# EAGLE board Accumulator Control Unit rev6 (EAGLE 9.6.2)
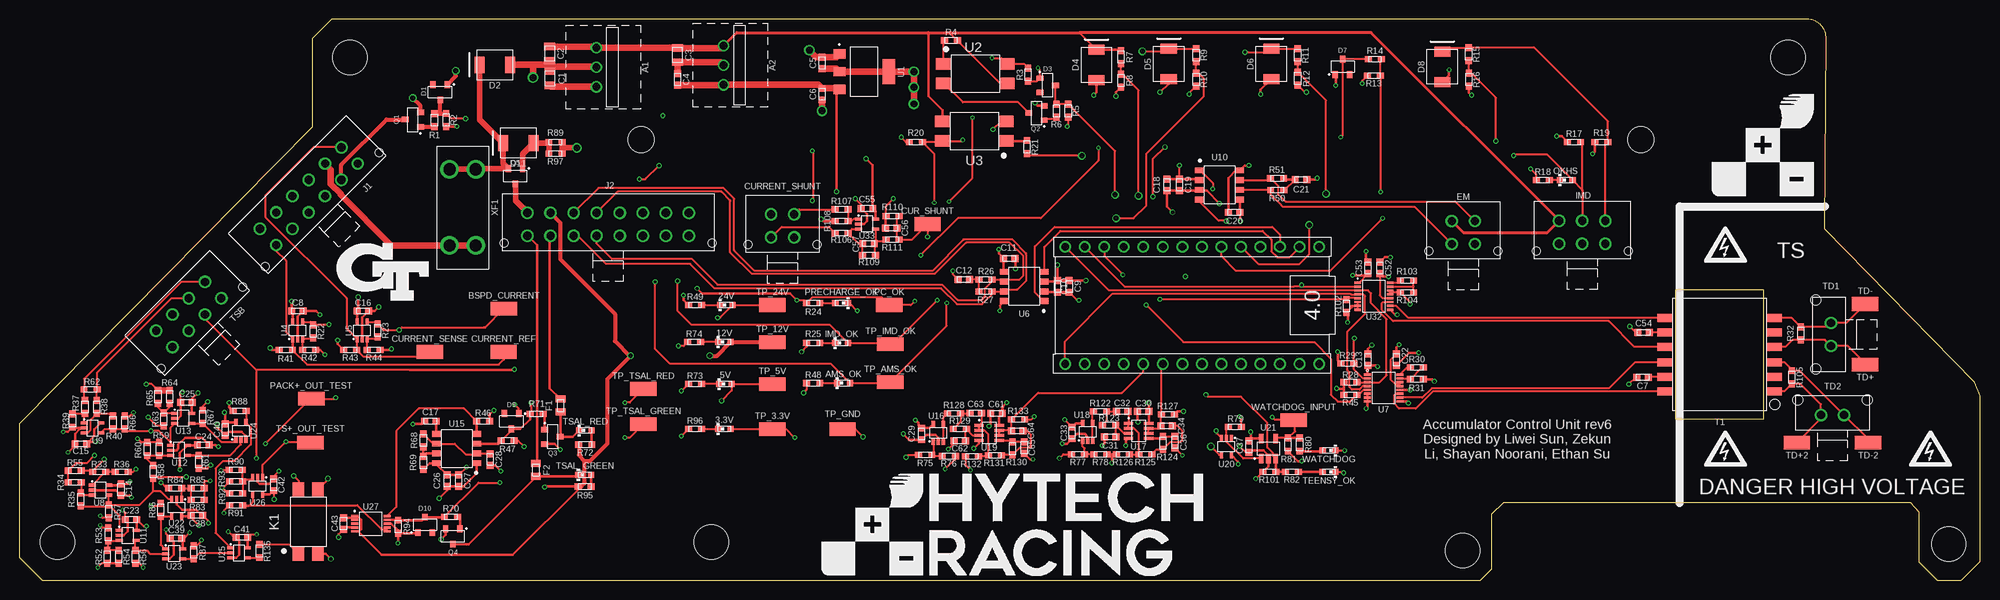
[diagram p6: board, top side]
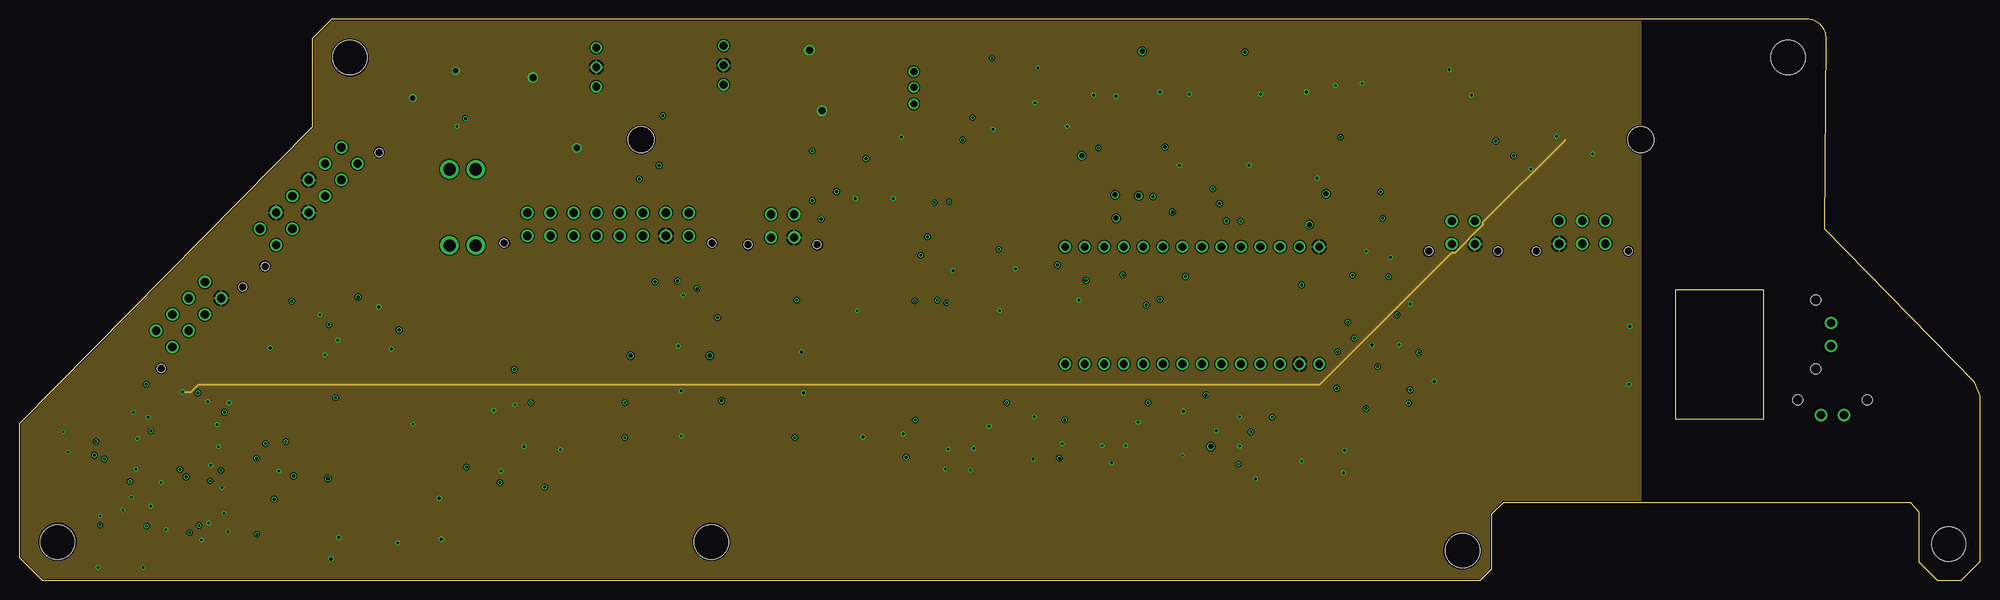
[diagram p7: board, inner layer Route2]
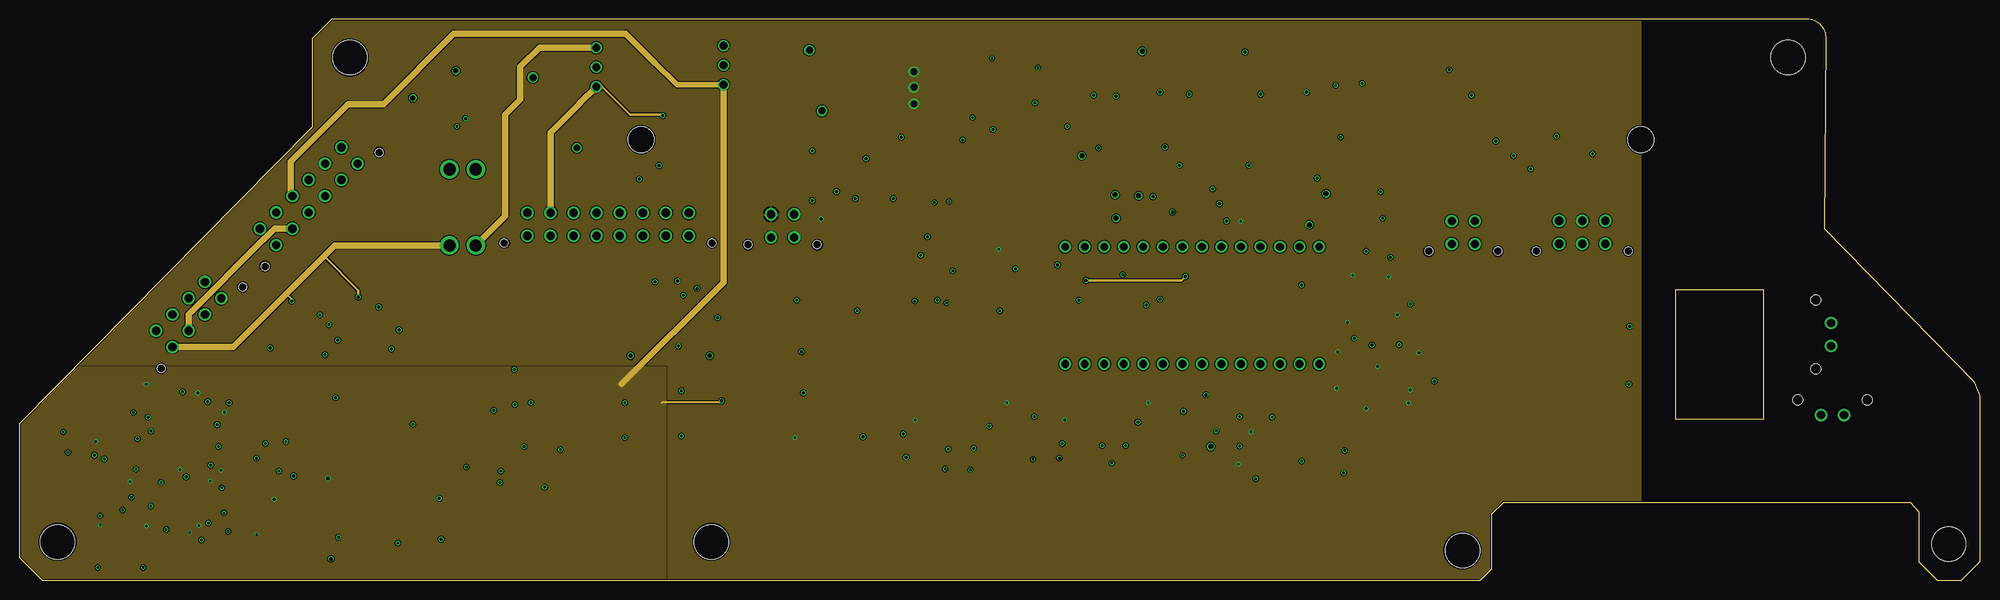
[diagram p8: board, inner layer Route15]
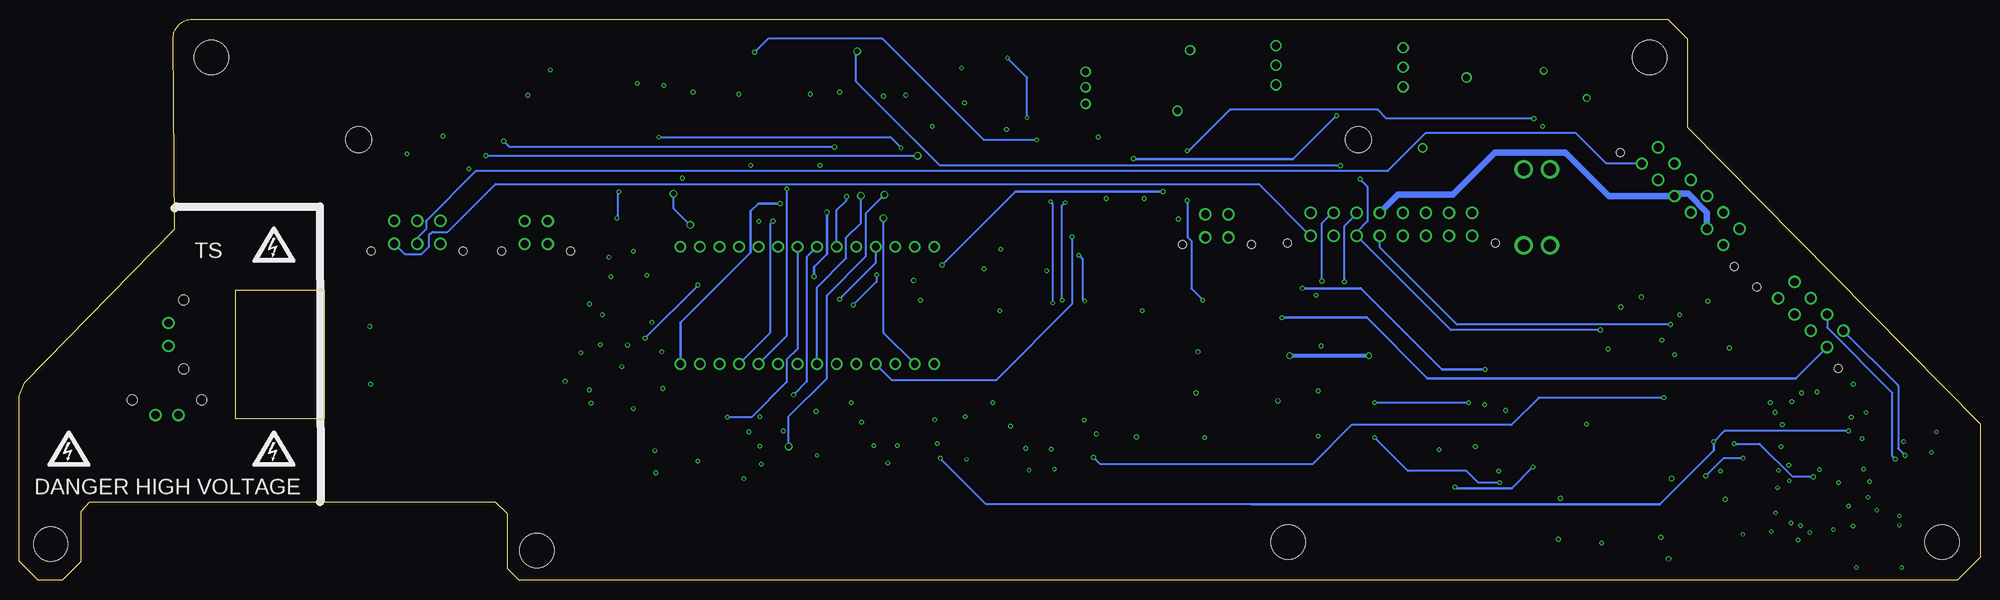
[diagram p9: board, bottom side, seen from below]

Size 255 x 73 mm. Coordinates in mm from the lower left corner, seen from the top.
Outline: 189.99,0 3,0 0,3 0,20.32 38.1,58.93 38.1,70.46 40.64,73 232.48,73 arc-90 234.98,70.48 234.77,45.71 254.29,25.73 255,23.98 255,2.5 252.5,0 249.43,0 247,2.43 247,8.9 245.91,10.16 193.04,10.16 191.52,8.64 191.52,1.52 189.99,0
Outline: 189.99,0 190,0
Copper layers (1+2*15+16): Top 0.035mm / dielectric 0.2mm / Route2 0.0175mm / dielectric 1.065mm / Route15 0.0175mm / dielectric 0.2mm / Bottom 0.035mm
Design rules "JLCPCB (4 Layer)": minimum track width 5mil, minimum drill 0.2mm, track to track 5mil, track to pad 5mil, pad to pad 5mil, via to via 20mil, smd to smd 5mil, copper to edge 0.2mm, drill to drill 21mil, minimum pad ring 6mil, minimum via ring 5mil, stop-mask expansion 2mil, vias tented up to drill 30mil, thermal gap 10mil

## Footprints (pad centres in the part's own frame; a part is rotated, then mirrored left to right if it is on the bottom)
0603-LED = smd 0.8 x 0.8: 1 -0.825,0; 2 0.825,0
OKI-78SR = drill 0.991: 1 -2.54,0; 2 0,0; 3 2.54,0
TEENSY_SHORT = drill 1.016: 3.3V 0,5.08; AGND/GND 0,2.54; D0 15.24,2.54; D1 15.24,5.08; D2 15.24,7.62; D3 15.24,10.16; D4 15.24,12.7; D5 15.24,15.24; D6 15.24,17.78; D7 15.24,20.32; D8 15.24,22.86; D9 15.24,25.4; D10 15.24,27.94; D11 15.24,30.48; D12 15.24,33.02; D13 0,33.02; D14 0,30.48; D15 0,27.94; D16 0,25.4; D17 0,22.86; D18 0,20.32; D19 0,17.78; D20 0,15.24; D21 0,12.7; D22 0,10.16; D23 0,7.62; GND 15.24,0; VIN 0,0
MICRO_MINIATURE = smd 3.429 x 1.778: 1 0,0
0805-CAP = smd 0.95 x 1.4: 1 -0.925,0; 2 0.925,0
0603-CAP = smd 0.9 x 0.9: 1 -0.75,0; 2 0.75,0
5015 = smd 3.429 x 1.778: 1 0,0
MOLEX_MICROFIT_PTH_VERTICAL_04_DUAL = drill 1.067: 1 1.499,-2.997; 2 -1.499,-2.997; 3 1.499,0; 4 -1.499,0 | hole 1.067: 4.496,0.94; -4.496,0.94
SOT-23 = smd 0.711 x 0.889: 1 -0.94,-1.003; 2 0.94,-1.003; 3 0,1.003
DO-214AA = smd 1.27 x 2.1: 1 -1.98,0; 2 1.98,0
1.5SMBJ = smd 1.27 x 2.1: 1 -1.98,0; 2 1.98,0
0603-FUSE = smd 0.914 x 1.27: 1 -0.838,0; 2 0.838,0
MOLEX_MICROFIT_PTH_VERTICAL_06_DUAL = drill 1.067: 1 2.997,-2.997; 2 0,-2.997; 3 -2.997,-2.997; 4 2.997,0; 5 0,0; 6 -2.997,0 | hole 1.067: 5.994,0.94; -5.994,0.94
MOLEX_MICROFIT_PTH_VERTICAL_12_DUAL = drill 1.067: 1 7.493,-2.997; 2 4.496,-2.997; 3 1.499,-2.997; 4 -1.499,-2.997; 5 -4.496,-2.997; 6 -7.493,-2.997; 7 7.493,0; 8 4.496,0; 9 1.499,0; 10 -1.499,0; 11 -4.496,0; 12 -7.493,0 | hole 1.067: 10.49,0.94; -10.49,0.94
MOLEX_MICROFIT_PTH_VERTICAL_16_DUAL = drill 1.067: 1 10.5,-3; 2 7.5,-3; 3 4.5,-3; 4 1.5,-3; 5 -1.5,-3; 6 -4.5,-3; 7 -7.5,-3; 8 -10.5,-3; 9 10.5,0; 10 7.5,0; 11 4.5,0; 12 1.5,0; 13 -1.5,0; 14 -4.5,0; 15 -7.5,0; 16 -10.5,0 | hole 1.067: 13.5,0.94; -13.5,0.94
DIP-4 = smd 1.5 x 1.9: 1 -1.27,-4.15; 2 1.27,-4.15; 3 -1.27,4.15; 4 1.27,4.15
0603-RES = smd 0.9 x 0.8: 1 -0.85,0; 2 0.85,0
HM2112ZNLT_AIRGAP = smd 1.02 x 1.89: 1 -4.78,-7.145; 2 -2.89,-7.145; 3 -1,-7.145; 4 1,-7.145; 5 2.875,-7.145; 6 4.78,-7.145; 7 4.78,7.145; 8 2.89,7.145; 9 1,7.145; 10 -1,7.145; 11 -2.89,7.145; 12 -4.78,7.145
MOLEX_MICROFIT_PTH_VERTICAL_02_SINGLE = drill 1.067: 1 1.499,0; 2 -1.499,0 | hole 1.321: 4.496,-1.956; -4.496,-1.956
MOLEX_MICROFIT_PTH_VERTICAL_08_DUAL = drill 1.067: 1 4.496,-2.997; 2 1.499,-2.997; 3 -1.499,-2.997; 4 -4.496,-2.997; 5 4.496,0; 6 1.499,0; 7 -1.499,0; 8 -4.496,0 | hole 1.067: 7.493,0.94; -7.493,0.94
SOT-223 = smd 1.2 x 1.6: 1 -2.3,-3.2; 2 0,-3.2; 3 2.3,-3.2 | smd 3.3 x 1.6: 4 0,3.2
SC-70-5 = smd 0.4 x 0.9: 1 -0.65,-1.1; 2 0,-1.1; 3 0.65,-1.1; 4 0.65,1.1; 5 -0.65,1.1
SOIC-08(NARROW,0.15") = smd 0.762 x 1.143: 1 -1.905,-2.603; 2 -0.635,-2.603; 3 0.635,-2.603; 4 1.905,-2.603; 5 1.905,2.603; 6 0.635,2.603; 7 -0.635,2.603; 8 -1.905,2.603
MSOP-16 = smd 0.305 x 0.889: 1 -1.75,-2.106; 2 -1.25,-2.106; 3 -0.75,-2.106; 4 -0.25,-2.106; 5 0.25,-2.106; 6 0.75,-2.106; 7 1.25,-2.106; 8 1.75,-2.106; 9 1.75,2.106; 10 1.25,2.106; 11 0.75,2.106; 12 0.25,2.106; 13 -0.25,2.106; 14 -0.75,2.106; 15 -1.25,2.106; 16 -1.75,2.106
SOT-23-8 = smd 0.4 x 1.22: 1 -0.975,-1.31; 2 -0.325,-1.31; 3 0.325,-1.31; 4 0.975,-1.31; 5 0.975,1.31; 6 0.325,1.31; 7 -0.325,1.31; 8 -0.975,1.31
SOT-23-5 = smd 0.62 x 1.22: 1 -0.95,-1.31; 2 0,-1.31; 3 0.95,-1.31; 4 0.95,1.31; 5 -0.95,1.31
MSOP-10 = smd 0.305 x 0.889: 1 -1,-2.106; 2 -0.5,-2.106; 3 0,-2.106; 4 0.5,-2.106; 5 1,-2.106; 6 1,2.106; 7 0.5,2.106; 8 0,2.106; 9 -0.5,2.106; 10 -1,2.106
MOUNTING_M4 = hole 4.5: 0,0
MOUNTING_M3 = hole 3.4: 0,0
3568 = drill 1.6: 1 -4.953,1.702; 2 -4.953,-1.702; 3 4.953,-1.702; 4 4.953,1.702

## Placement (x,y rotation side)
3.3V  LED_0603_GREEN  [0603-LED]  91.69,19.68 0 top
5V  LED_0603_BLUE  [0603-LED]  91.82,25.53 0 top
12V  LED_0603_RED  [0603-LED]  91.69,30.99 0 top
24V  LED_0603_ORANGE  [0603-LED]  91.95,35.81 0 top
A1  VOLTAGE_REGULATOR_MODULE_OKI-78SR_12V  [OKI-78SR]  75.05,66.76 270 top
A2  VOLTAGE_REGULATOR_MODULE_OKI-78SR_5V  [OKI-78SR]  91.59,67.02 270 top
A3  TEENSY_4.0TH  [TEENSY_SHORT]  169.02,28.16 90 top
AMS_OK  LED_0603_GREEN  [0603-LED]  107.19,25.65 0 top
BSPD_CURRENT  TEST_POINT  [MICRO_MINIATURE]  63.02,35.33 180 top
C1  CAPACITOR_0805_50V_10UF  [0805-CAP]  68.99,65.31 90 top
C2  CAPACITOR_0805_50V_10UF  [0805-CAP]  68.98,68.53 270 top
C3  CAPACITOR_0805_50V_10UF  [0805-CAP]  85.6,68.33 270 top
C4  CAPACITOR_0603_25V_10UF  [0603-CAP]  85.6,65.15 90 top
C5  CAPACITOR_0603_10V_4.7UF  [0603-CAP]  104.39,67.31 90 top
C6  CAPACITOR_0603_10V_1UF  [0603-CAP]  104.39,63.25 270 top
C7  CAPACITOR_0603_10V_10NF  [0603-CAP]  211.07,26.42 180 top
C8  CAPACITOR_0603_50V_0.1UF  [0603-CAP]  36.2,35.05 0 top
C9  CAPACITOR_0603_10V_1UF  [0603-CAP]  136.53,38.23 90 top
C10  CAPACITOR_0603_10V_0.1UF  [0603-CAP]  135,38.23 90 top
C11  CAPACITOR_0603_10V_0.1UF  [0603-CAP]  128.75,41.86 180 top
C12  CAPACITOR_0603_10V_4.7NF  [0603-CAP]  122.83,39.13 0 top
C13  CAPACITOR_0603_10V_10NF  [0603-CAP]  175.39,28.7 270 top
C14  CAPACITOR_0603_10V_0.1UF  [0603-CAP]  13.23,11.81 270 top
C15  CAPACITOR_0603_10V_0.1UF  [0603-CAP]  8,17.75 180 top
C16  CAPACITOR_0603_50V_0.1UF  [0603-CAP]  44.7,35.05 0 top
C17  CAPACITOR_0603_10V_10NF  [0603-CAP]  53.47,20.7 180 top
C18  CAPACITOR_0603_10V_1UF  [0603-CAP]  149.22,51.44 270 top
C19  CAPACITOR_0603_10V_0.1UF  [0603-CAP]  150.88,51.44 270 top
C20  CAPACITOR_0603_10V_0.1UF  [0603-CAP]  157.99,47.88 0 top
C21  CAPACITOR_0603_10V_4.7NF  [0603-CAP]  166.67,52.15 180 top
C22  CAPACITOR_0603_10V_0.1UF  [0603-CAP]  179.07,28.7 90 top
C23  CAPACITOR_0603_10V_0.1UF  [0603-CAP]  14.55,7.9 180 top
C24  CAPACITOR_0603_10V_0.1UF  [0603-CAP]  23.93,17.63 0 top
C25  CAPACITOR_0603_10V_0.1UF  [0603-CAP]  21.77,23.16 180 top
C26  CAPACITOR_0603_25V_0.1UF  [0603-CAP]  55.63,12.95 270 top
C27  CAPACITOR_0603_25V_1UF  [0603-CAP]  57.15,12.95 270 top
C28  CAPACITOR_0603_10V_4.7UF  [0603-CAP]  61.21,15.72 270 top
C29  CAPACITOR_0603_25V_0.1UF  [0603-CAP]  117.35,19.05 270 top
C30  CAPACITOR_0603_10V_0.1UF  [0603-CAP]  146.18,21.97 180 top
C31  CAPACITOR_0603_16V_0.47UF  [0603-CAP]  141.86,18.67 180 top
C32  CAPACITOR_0603_10V_1UF  [0603-CAP]  143.41,22 180 top
C33  CAPACITOR_0603_10V_0.1UF  [0603-CAP]  136.91,19.18 270 top
C34  CAPACITOR_0603_10V_1UF  [0603-CAP]  149.22,20.07 0 top
C36  CAPACITOR_0603_16V_0.47UF  [0603-CAP]  150.27,17.96 270 top
C37  CAPACITOR_0603_10V_0.1UF  [0603-CAP]  159.89,17.4 90 top
C38  CAPACITOR_0603_10V_0.1UF  [0603-CAP]  23.11,8.43 0 top
C39  CAPACITOR_0603_10V_0.1UF  [0603-CAP]  20.4,5.49 180 top
C40  CAPACITOR_0603_10V_0.1UF  [0603-CAP]  26.77,19.61 270 top
C41  CAPACITOR_0603_10V_0.1UF  [0603-CAP]  28.98,5.59 180 top
C42  CAPACITOR_0603_10V_0.1UF  [0603-CAP]  33.07,12.42 90 top
C43  CAPACITOR_0603_25V_1UF  [0603-CAP]  42.16,7.39 270 top
C52  CAPACITOR_0603_10V_10NF  [0603-CAP]  176.91,40.64 270 top
C53  CAPACITOR_0603_10V_0.1UF  [0603-CAP]  175.39,40.64 90 top
C54  CAPACITOR_0603_10V_10NF  [0603-CAP]  211.2,32.26 180 top
C55  CAPACITOR_0603_25V_1UF  [0603-CAP]  110.24,48.39 180 top
C56  CAPACITOR_0603_10V_68NF  [0603-CAP]  113.41,45.85 180 top
C57  CAPACITOR_0603_10V_68NF  [0603-CAP]  110.44,43.81 180 top
C61  CAPACITOR_0603_10V_0.1UF  [0603-CAP]  127.08,21.72 180 top
C62  CAPACITOR_0603_16V_0.47UF  [0603-CAP]  122.3,18.16 180 top
C63  CAPACITOR_0603_10V_1UF  [0603-CAP]  124.36,21.74 180 top
C64  CAPACITOR_0603_10V_1UF  [0603-CAP]  129.79,19.43 0 top
C65  CAPACITOR_0603_16V_0.47UF  [0603-CAP]  130.68,17.27 270 top
CUR_SHUNT  TEST_POINT  [5015]  118.11,46.35 0 top
CURRENT_REF  TEST_POINT  [MICRO_MINIATURE]  62.99,29.72 0 top
CURRENT_SENSE  TEST_POINT  [MICRO_MINIATURE]  53.39,29.72 0 top
CURRENT_SHUNT  CONNECTOR-4_μF_T_V_BLACK  [MOLEX_MICROFIT_PTH_VERTICAL_04_DUAL]  99.27,44.61 180 top
D1  TVS__8V  [SOT-23]  54.74,63.5 180 top
D2  TVS_DO-214AA_30V  [DO-214AA]  61.85,67.06 180 top
D3  TVS__8V  [SOT-23]  133.73,64.39 270 top
D4  TVS_DO-214AA_28V  [DO-214AA]  140.08,67.06 90 top
D5  TVS_DO-214AA_28V  [DO-214AA]  149.48,67.18 90 top
D6  TVS_DO-214AA_28V  [DO-214AA]  162.81,67.18 90 top
D7  TVS__8V  [SOT-23]  172.09,66.8 0 top
D8  TVS_DO-214AA_28V  [DO-214AA]  185.04,66.8 90 top
D9  TVS__15V  [SOT-23]  64.01,20.7 180 top
D10  TVS__15V  [SOT-23]  52.76,7.21 0 top
D11  ZENER_1.5SMBJ_12V  [1.5SMBJ]  64.9,56.9 180 top
EM  CONNECTOR-4_μF_T_V_BLACK  [MOLEX_MICROFIT_PTH_VERTICAL_04_DUAL]  187.78,43.75 180 top
F1  FUSE_0603_.75A  [0603-FUSE]  70.38,22.73 270 top
F2  FUSE_0603_.75A  [0603-FUSE]  67.18,14.35 270 top
IMD  CONNECTOR-6_μF_T_V_BLACK  [MOLEX_MICROFIT_PTH_VERTICAL_06_DUAL]  203.24,43.78 180 top
IMD_OK  LED_0603_ORANGE  [0603-LED]  106.93,30.86 0 top
J1  CONNECTOR-12_MF_T_V_  [MOLEX_MICROFIT_PTH_VERTICAL_12_DUAL]  38.71,48.92 225 top
J2  CONNECTOR-16_MF_T_V_  [MOLEX_MICROFIT_PTH_VERTICAL_16_DUAL]  76.58,44.82 180 top
K1  RELAY_SOLIDSTATE_NO_DIP-4  [DIP-4]  37.59,7.62 0 top
OKHS  LED_0603_YELLOW  [0603-LED]  201.17,52.07 0 top
PACK+_OUT_TEST  TEST_POINT  [MICRO_MINIATURE]  37.97,23.62 0 top
PC_OK  TEST_POINT  [MICRO_MINIATURE]  113.16,35.81 0 top
PRECHARGE_OK  LED_0603_RED  [0603-LED]  106.93,36.07 180 top
Q1  TRANSISTOR_N_MOS__PMV15ENEA  [SOT-23]  51.18,59.94 90 top
Q2  TRANSISTOR_N_MOS__PMV15ENEA  [SOT-23]  132.28,60.81 90 top
Q3  TRANSISTOR_N_MOS__PMV15ENEA  [SOT-23]  69.34,18.67 270 top
Q4  TRANSISTOR_N_MOS__PMV15ENEA  [SOT-23]  56.39,5.71 180 top
Q5  TRANSISTOR_P_MOS_SOT-23_DMP3056L-7  [SOT-23]  64.52,52.58 180 top
R1  RESISTOR_0603_10  [0603-RES]  53.98,59.87 270 top
R2  RESISTOR_0603_10K  [0603-RES]  55.5,59.89 270 top
R3  RESISTOR_0603_20K  [0603-RES]  131.19,65.79 90 top
R4  RESISTOR_0603_5.1K  [0603-RES]  121.16,70.23 0 top
R5  RESISTOR_0603_10K  [0603-RES]  136.4,61.09 270 top
R6  RESISTOR_0603_10  [0603-RES]  134.87,61.09 270 top
R7  RESISTOR_0603_36.5K  [0603-RES]  143.26,68.07 270 top
R8  RESISTOR_0603_4.64K  [0603-RES]  143.26,65.02 270 top
R9  RESISTOR_0603_36.5K  [0603-RES]  153.03,68.33 270 top
R10  RESISTOR_0603_4.64K  [0603-RES]  153.03,65.15 270 top
R11  RESISTOR_0603_36.5K  [0603-RES]  166.24,68.33 270 top
R12  RESISTOR_0603_4.64K  [0603-RES]  166.24,65.28 270 top
R13  RESISTOR_0603_  [0603-RES]  176.15,65.66 180 top
R14  RESISTOR_0603_18.7K  [0603-RES]  176.28,67.82 0 top
R15  RESISTOR_0603_  [0603-RES]  188.47,68.45 270 top
R16  RESISTOR_0603_5.1K  [0603-RES]  188.49,65.15 270 top
R17  RESISTOR_0603_2.2K  [0603-RES]  202.18,57.02 0 top
R18  RESISTOR_0603_2K  [0603-RES]  198.12,52.07 0 top
R19  RESISTOR_0603_2.2K  [0603-RES]  205.74,57.02 0 top
R20  RESISTOR_0603_20K  [0603-RES]  116.59,57.02 0 top
R21  RESISTOR_0603_5.1K  [0603-RES]  131.06,56.39 90 top
R22  RESISTOR_0603_10.5K  [0603-RES]  38.23,32.38 90 top
R23  RESISTOR_0603_10.5K  [0603-RES]  46.61,32.51 90 top
R24  RESISTOR_0603_1K  [0603-RES]  103.25,36.07 180 top
R25  RESISTOR_0603_2K  [0603-RES]  103.25,30.86 0 top
R26  RESISTOR_0603_60.4  [0603-RES]  125.65,39.12 0 top
R27  RESISTOR_0603_60.4  [0603-RES]  125.64,37.59 0 top
R28  RESISTOR_0603_2K  [0603-RES]  173.1,25.78 180 top
R29  RESISTOR_0603_2K  [0603-RES]  172.72,28.19 180 top
R30  RESISTOR_0603_1.65K  [0603-RES]  181.74,27.69 0 top
R31  RESISTOR_0603_470  [0603-RES]  181.74,26.16 0 top
R32  RESISTOR_0603_120  [0603-RES]  231.65,32.13 270 top
R33  RESISTOR_0603_18.7K_LT  [0603-RES]  10.41,14.1 0 top
R34  RESISTOR_0603_18.7K_LT  [0603-RES]  7.24,12.75 0 top
R35  RESISTOR_0603_43K_LT  [0603-RES]  8,10.54 270 top
R36  RESISTOR_0603_43K_LT  [0603-RES]  13.34,14.1 0 top
R37  RESISTOR_0603_18.7K_LT  [0603-RES]  8.56,22.56 270 top
R38  RESISTOR_0603_18.7K_LT  [0603-RES]  10.08,22.56 270 top
R39  RESISTOR_0603_43K_LT  [0603-RES]  6.93,20.78 270 top
R40  RESISTOR_0603_43K_LT  [0603-RES]  12.19,20.52 270 top
R41  RESISTOR_0603_DNP  [0603-RES]  34.67,29.97 0 top
R42  RESISTOR_0603_2.74K  [0603-RES]  37.72,29.97 180 top
R43  RESISTOR_0603_100K  [0603-RES]  43.05,29.97 0 top
R44  RESISTOR_0603_2.74K  [0603-RES]  46.1,29.97 180 top
R45  RESISTOR_0603_1K  [0603-RES]  173.1,24.13 180 top
R46  RESISTOR_0603_10K  [0603-RES]  60.33,20.7 180 top
R47  RESISTOR_0603_10K  [0603-RES]  63.5,18.16 0 top
R48  RESISTOR_0603_2K  [0603-RES]  103.25,25.65 0 top
R49  RESISTOR_0603_3.3K  [0603-RES]  87.88,35.81 0 top
R50  RESISTOR_0603_60.4  [0603-RES]  163.58,50.77 180 top
R51  RESISTOR_0603_60.4  [0603-RES]  163.57,52.3 180 top
R52  RESISTOR_0603_DNP  [0603-RES]  11.43,3.05 90 top
R53  RESISTOR_0603_5.9K  [0603-RES]  11.56,5.97 90 top
R54  RESISTOR_0603_11.5K  [0603-RES]  12.95,3.05 90 top
R55  RESISTOR_0603_10K  [0603-RES]  7.24,14.27 0 top
R56  RESISTOR_0603_10K  [0603-RES]  15.11,3.05 90 top
R57  RESISTOR_0603_10K  [0603-RES]  11.63,8.97 90 top
R58  RESISTOR_0603_36.5K  [0603-RES]  17.42,14.12 270 top
R59  RESISTOR_0603_330K  [0603-RES]  18.21,17.07 270 top
R60  RESISTOR_0603_DNP  [0603-RES]  16.66,17.07 270 top
R61  RESISTOR_0603_10K  [0603-RES]  23.32,15.42 90 top
R62  RESISTOR_0603_10K  [0603-RES]  9.27,24.84 180 top
R63  RESISTOR_0603_14K  [0603-RES]  18.8,20.95 90 top
R64  RESISTOR_0603_DNP  [0603-RES]  19.56,23.88 90 top
R65  RESISTOR_0603_1K  [0603-RES]  18.03,23.88 90 top
R66  RESISTOR_0603_10K  [0603-RES]  13.72,20.52 270 top
R67  RESISTOR_0603_10K  [0603-RES]  23.88,21.29 270 top
R68  RESISTOR_0603_43K  [0603-RES]  52.55,18.21 270 top
R69  RESISTOR_0603_10K  [0603-RES]  52.55,15.29 270 top
R70  RESISTOR_0603_10  [0603-RES]  56.13,8.26 0 top
R71  RESISTOR_0603_10  [0603-RES]  67.26,21.67 0 top
R72  RESISTOR_0603_2K  [0603-RES]  73.61,17.65 0 top
R73  RESISTOR_0603_1K  [0603-RES]  87.88,25.53 0 top
R74  RESISTOR_0603_2K  [0603-RES]  87.76,30.99 0 top
R75  RESISTOR_0603_10K  [0603-RES]  117.81,16.31 0 top
R76  RESISTOR_0603_12K  [0603-RES]  120.88,16.15 0 top
R77  RESISTOR_0603_10K  [0603-RES]  137.67,16.38 0 top
R78  RESISTOR_0603_12K  [0603-RES]  140.59,16.38 0 top
R79  RESISTOR_0603_10K  [0603-RES]  158.06,19.94 180 top
R80  RESISTOR_0603_470  [0603-RES]  166.5,17.65 90 top
R81  RESISTOR_0603_10K  [0603-RES]  164.97,17.65 90 top
R82  RESISTOR_0603_470  [0603-RES]  165.48,14.1 180 top
R83  RESISTOR_0603_1K  [0603-RES]  23.22,10.46 0 top
R84  RESISTOR_0603_14K  [0603-RES]  20.29,11.99 0 top
R85  RESISTOR_0603_DNP  [0603-RES]  23.22,11.99 0 top
R86  RESISTOR_0603_10K  [0603-RES]  18.39,9.17 270 top
R87  RESISTOR_0603_10K  [0603-RES]  22.71,3.63 270 top
R88  RESISTOR_0603_10K  [0603-RES]  28.65,22.02 0 top
R89  RESISTOR_0603_1K  [0603-RES]  69.72,57.02 180 top
R90  RESISTOR_0603_73.2K  [0603-RES]  28.17,14.38 180 top
R91  RESISTOR_0603_10K  [0603-RES]  28.19,9.75 0 top
R92  RESISTOR_0603_1M  [0603-RES]  28.19,11.33 0 top
R93  RESISTOR_0603_8.66K  [0603-RES]  28.19,12.85 0 top
R94  RESISTOR_0603_10K  [0603-RES]  49.28,6.99 270 top
R95  RESISTOR_0603_2K  [0603-RES]  73.53,12.19 0 top
R96  RESISTOR_0603_1K  [0603-RES]  87.88,19.68 0 top
R97  RESISTOR_0603_1K  [0603-RES]  69.72,55.5 180 top
R101  RESISTOR_0603_10K  [0603-RES]  162.56,14.1 0 top
R102  RESISTOR_0603_1K  [0603-RES]  172.59,35.69 270 top
R103  RESISTOR_0603_1.65K  [0603-RES]  180.47,38.99 0 top
R104  RESISTOR_0603_470  [0603-RES]  180.47,37.47 180 top
R105  RESISTOR_0603_120  [0603-RES]  230.5,26.42 270 top
R106  RESISTOR_0603_10K  [0603-RES]  106.91,45.19 0 top
R107  RESISTOR_0603_10K  [0603-RES]  106.93,48.26 0 top
R108  RESISTOR_0603_10K  [0603-RES]  106.93,46.74 180 top
R109  RESISTOR_0603_10K  [0603-RES]  110.49,42.29 0 top
R110  RESISTOR_0603_5.1K  [0603-RES]  113.54,47.37 180 top
R111  RESISTOR_0603_4.12K  [0603-RES]  113.54,44.32 0 top
R122  RESISTOR_0603_12K  [0603-RES]  140.56,21.97 0 top
R123  RESISTOR_0603_7.5K  [0603-RES]  141.73,20.19 0 top
R124  RESISTOR_0603_7.5K  [0603-RES]  148.74,17.86 90 top
R125  RESISTOR_0603_12K  [0603-RES]  146.43,16.38 0 top
R126  RESISTOR_0603_12K  [0603-RES]  143.51,16.38 0 top
R127  RESISTOR_0603_20K  [0603-RES]  149.35,21.59 180 top
R128  RESISTOR_0603_12K  [0603-RES]  121.54,21.72 0 top
R129  RESISTOR_0603_7.5K  [0603-RES]  122.3,19.68 0 top
R130  RESISTOR_0603_7.5K  [0603-RES]  129.16,17.14 90 top
R131  RESISTOR_0603_12K  [0603-RES]  126.87,16.26 0 top
R132  RESISTOR_0603_12K  [0603-RES]  123.9,16.13 0 top
R133  RESISTOR_0603_20K  [0603-RES]  129.9,20.95 180 top
R135  RESISTOR_0603_470  [0603-RES]  31.24,3.81 270 top
T1  TRANSFORMER_HM2112ZNLT_AIRGAP  [HM2112ZNLT_AIRGAP]  221.11,29.36 90 top
TD1  CONNECTOR-2_MF_T_V_  [MOLEX_MICROFIT_PTH_VERTICAL_02_SINGLE]  235.59,31.99 270 top
TD2  CONNECTOR-2_MF_T_V_  [MOLEX_MICROFIT_PTH_VERTICAL_02_SINGLE]  235.78,21.5 180 top
TD+  TEST_POINT  [MICRO_MINIATURE]  240.03,28.07 180 top
TD+2  TEST_POINT  [MICRO_MINIATURE]  231.14,17.91 180 top
TD-  TEST_POINT  [MICRO_MINIATURE]  240.03,35.94 0 top
TD-2  TEST_POINT  [MICRO_MINIATURE]  240.41,17.91 180 top
TEENSY_OK  LED_0603_RED  [0603-LED]  170.31,14.1 180 top
TP_3.3V  TEST_POINT  [5015]  97.92,19.68 0 top
TP_5V  TEST_POINT  [5015]  97.92,25.53 0 top
TP_12V  TEST_POINT  [5015]  97.92,30.99 0 top
TP_24V  TEST_POINT  [5015]  97.92,35.81 0 top
TP_AMS_OK  TEST_POINT  [MICRO_MINIATURE]  113.28,25.78 0 top
TP_GND  TEST_POINT  [5015]  107.06,19.68 0 top
TP_IMD_OK  TEST_POINT  [MICRO_MINIATURE]  113.28,30.73 0 top
TP_TSAL_GREEN  TEST_POINT  [MICRO_MINIATURE]  81.15,20.32 0 top
TP_TSAL_RED  TEST_POINT  [MICRO_MINIATURE]  81.15,24.89 0 top
TS+_OUT_TEST  TEST_POINT  [MICRO_MINIATURE]  37.85,17.91 0 top
TSAL_GREEN  LED_0603_GREEN  [0603-LED]  73.53,13.72 0 top
TSAL_RED  LED_0603_RED  [0603-LED]  73.61,19.48 0 top
TSB  CONNECTOR-8_μF_T_V_BLACK  [MOLEX_MICROFIT_PTH_VERTICAL_08_DUAL]  23.1,33.52 225 top
U1  VOLTAGE_REGULATOR_SOT-223_3.3V  [SOT-223]  109.86,66.17 270 top
U2  RELAY_SOLIDSTATE_NO_DIP-4  [DIP-4]  124.33,65.91 270 top
U3  RELAY_SOLIDSTATE_NO_DIP-4  [DIP-4]  124.21,58.42 90 top
U4  OPAMP_1_CHANNEL_OPA991  [SC-70-5]  36.2,32.51 0 top
U5  OPAMP_1_CHANNEL_OPA991  [SC-70-5]  44.58,32.51 0 top
U6  TCAN1051HQV-Q1  [SOIC-08(NARROW,0.15")]  130.68,38.23 90 top
U7  LTC6820  [MSOP-16]  177.42,25.02 270 top
U8  OPAMP_1_CHANNEL_OPA991  [SC-70-5]  10.57,11.73 270 top
U9  OPAMP_1_CHANNEL_OPA991  [SC-70-5]  9.53,19.81 270 top
U10  TCAN1051HQV-Q1  [SOIC-08(NARROW,0.15")]  156.08,51.44 270 top
U11  OPAMP_1_CHANNEL_OPA991  [SC-70-5]  14.1,5.84 270 top
U12  OPAMP_1_CHANNEL_OPA991  [SC-70-5]  20.78,16.92 270 top
U13  OPAMP_1_CHANNEL_OPA991  [SC-70-5]  21.34,21.08 270 top
U15  LM555  [SOIC-08(NARROW,0.15")]  56.9,17.14 90 top
U16  OPAMP_1_CHANNEL_OPA991  [SC-70-5]  119.51,19.18 0 top
U17  OPAMP_2_CHANNEL_OPA_2991  [SOT-23-8]  145.54,19.43 270 top
U18  OPAMP_1_CHANNEL_OPA991  [SC-70-5]  138.94,19.3 0 top
U19  OPAMP_2_CHANNEL_OPA_2991  [SOT-23-8]  126.11,19.18 270 top
U20  LOGICGATE_BUFFER  [SC-70-5]  156.97,17.4 180 top
U21  ADM8316WBX30  [SOT-23-5]  162.43,17.14 0 top
U22  OPAMP_1_CHANNEL_OPA991  [SC-70-5]  20.47,9.45 180 top
U23  LOGICGATE_AND_DCK3  [SC-70-5]  20.14,3.45 270 top
U24  LOGICGATE_AND_DCK3  [SC-70-5]  28.83,19.43 0 top
U25  LOGICGATE_AND_DCK3  [SC-70-5]  28.57,3.56 270 top
U26  OPAMP_1_CHANNEL_OPA991  [SC-70-5]  30.99,12.27 180 top
U27  ADG1423  [MSOP-10]  45.72,7.37 270 top
U32  LTC6820  [MSOP-16]  176.15,36.96 270 top
U33  OPAMP_1_CHANNEL_OPA991  [SC-70-5]  110.24,46.35 270 top
U$1  [MOUNTING_M4]  250.91,4.73 0 top
U$2  [MOUNTING_M4]  187.67,3.86 0 top
U$3  [MOUNTING_M4]  5,5 0 top
U$4  [MOUNTING_M4]  43,68 0 top
U$5  [MOUNTING_M4]  230,68 0 top
U$6  [MOUNTING_M4]  90,5 0 top
U$7  [MOUNTING_M3]  80.85,57.33 0 top
U$8  [MOUNTING_M3]  210.85,57.33 0 bottom
U$9  [TS]  230.38,42.93 0 top
U$10  [HV_MEDIUM]  221.87,17.14 0 top
U$11  [HV_MEDIUM]  248.54,17.14 0 bottom
U$12  [LOGO_HYTECH_SQUARE_EXTRA_LARGE]  226.69,56.64 0 top
U$13  [HV_MEDIUM]  221.87,43.69 0 top
U$14  [HV_MEDIUM]  248.54,17.14 0 top
U$15  [HV_MEDIUM]  221.87,43.69 0 bottom
U$16  [LOGO_HYTECH_LARGE]  104.27,0.64 0 top
U$17  [LOGO_GT_MEDIUM]  47.24,40.13 0 top
U$19  [DANGER_HIGH_VOLTAGE]  235.71,12.19 0 top
U$101  [HV_MEDIUM]  221.87,17.14 0 bottom
WATCHDOG  LED_0603_BLUE  [0603-LED]  170.31,16.89 180 top
WATCHDOG_INPUT  TEST_POINT  [MICRO_MINIATURE]  165.74,20.83 0 top
XF1  FUSE_HOLDER_MINIBLADEPTH  [3568]  57.66,48.51 270 top

## Tracks (layer width: path | path; a pad name or v marks a point on that pad's centre or on a via)
0.90X_DIV
  Top 0.254: U12.3 19.63,16.22 R59.2 R60.2 16.66,15.73 R58.1
0.525V_DIV
  Top 0.254: R90.1 29.02,13.08 | 29.02,13.08 29.02,12.88 R93.2 R92.2 | U26.3 30.05,13.08 29.02,13.08
3.305V_DIV
  Top 0.254: U11.3 12.92,5.12 R53.1 11.56,4.03 R52.2 R54.2
4.66V_DIV_A
  Top 0.254: U13.1 18.87,21.73 R63.2 | R63.2 19.56,22.57 R64.1 | R63.2 18.03,22.57 R65.1
4.66V_DIV_B
  Top 0.254: U22.1 21.12,11.97 R84.2 22.35,11.99 | 22.35,11.99 R85.1 | R83.1 22.35,10.48 22.35,11.99
24V_SCALED_3.3V  (via drill 0.65)
  Top 0.254: R8.1 143.26,66.04 | 143.26,66.04 R7.2 | v145.54,50.04 145.54,63.75 143.26,66.04
  Bottom 0.254: A3.D19 151.24,38.11 147.46,41.9 147.46,44.59 145.54,46.51 v145.54,50.04
24VIN
  Top 0.711: J2.1 64.52,49.38 Q5.3
60V_THRESHOLD
  Top 0.254: U26.4 30.34,10.14 29.84,9.65 29.15,9.65 R91.2 43.97,9.75 47.12,6.6 47.83,6.6 | U27.6 47.83,6.6 | 47.83,6.6 U27.7
+3V3  (via drill 0.35, 0.9)
  Top 0.254: 3.3V.2 TP_3.3V.1 99.69,19.68 v100.84,18.54 | C52.2 176.91,37.08 177.29,36.71 U32.12 | U32.8 U32.7 U32.6 | U7.8 U7.6 U7.7 | C20.2 158.74,46.8 v158.83,46.71
  Top 0.305: U16.5 118.38,19.8 C29.1 116.92,20.23 116.92,20.45 v116.51,20.85 | U19.8 127.42,21.31 C61.1 127.83,22.54 v128.4,23.11 | U18.5 137.38,20.4 C33.1 135.97,20.87 v135.97,20.88 | U17.8 146.93,20.48 C30.1 146.93,23 v146.81,23.11 | U6.5 128,40.21 C11.2 127.38,42.48 v127.38,43.05 | C20.2 158.74,49.48 U10.5 | U21.5 160.2,18.45 C37.2 160.15,18.4 v160.15,19.3 | U20.5 158.5,15.43 v158.5,15.11 | R108.2 104.52,46.74 v104.27,46.99 | U32.1 174.2,38.71 C53.1 175.17,39.67 v173.4,39.67 | U32.7 173.25,35.71 173.23,35.69 173.23,35.47 R102.2 172.75,34.69 v172.75,33.55 | U7.1 175.31,27.88 C13.2 176.52,27.95 v176.66,27.81 | U7.8 175.31,22.53 v175.13,22.35 | R45.2 172.25,24.89 | 172.25,24.89 R28.2 | 172.25,24.89 171.52,24.89 171.45,24.97 v171.29,24.97 | R29.2 171.45,28.61 v171.45,29.72 | C52.2 177.3,39.5 v178.05,39.5 | U32.9 178.92,34.54 v179.2,34.54 | U7.9 180.44,23.27 v180.65,23.06 | U7.12 v180.84,24.77 v180.85,24.77 | C22.1 180.71,29.59 v181.99,29.59
  Top 0.813: C5.1 106.26,66.56 U1.2 U1.4 v116.33,66.17 v116.33,64.14 v116.33,61.98
  pour Route15 (rank 2): -1.78,74.55 -1.78,-8.64 199.94,-8.64 210.95,2.37 210.95,81.92 -9.14,81.92
+5V  (via drill 0.3, 0.35, 0.4, 0.45)
  Top 0.254: TP_5V.1 5V.2 92.65,24.7 v91.31,23.37 | C14.1 14.14,12.56 v14.4,12.83 | R53.2 10.89,6.82 v10.54,7.17 | C23.1 16.19,7.01 16.51,7.01 v16.56,7.06 | C39.1 21.44,5.49 v22.17,6.22 | R83.2 R85.2 24.07,12.93 v24.84,12.93 | R90.2 27.27,14.32 26.26,14.32 v26.24,14.3 | C41.1 30.11,5.97 v30.89,5.97 | R65.2 17.23,25.53 v16.51,25.53 | C25.1 22.52,23.66 v23.24,24.38 | C42.1 33.07,10.62 v33.15,10.54
  Top 0.305: U9.5 9.78,19.62 9.78,18.78 C15.1 9.03,18.03 v9.96,18.03 | U8.5 13.06,12.38 C14.1 | U11.5 15.3,6.6 C23.1 | U23.5 21.24,5.39 C39.1 | U22.5 22.28,8.35 C38.1 22.36,8.12 v23.37,7.11 | U24.5 26.94,20.53 C40.1 26.77,21.61 26.67,21.72 v26.67,21.84 | C41.1 29.73,4.26 U25.5 | U26.5 32.57,11.17 C42.1 33.15,11.59 | U13.5 22.44,23.08 C25.1 | C10.2 134.89,38.86 U6.3 | C10.2 C9.2 138.67,38.98 v138.68,38.99 | 153.36,50.69 C19.2 C18.2 149.22,48.64 v149.99,47.88 | 153.36,50.69 U10.3 | 153.36,50.69 154.42,50.69 v156.08,49.02 | C10.2 v135,41.02 | v106.3,50.55 106.3,63.77 106.53,64 | C24.1 23.12,17.57 U12.5 20.89,16.58 v20.89,14.42 | K1.4 40.13,13.04 v40.13,13.21
  Top 0.813: C4.1 91.52,64.4 A2.3 103.92,64.47 C6.1 106.53,64 U1.3 | R64.2 R65.2
  Route15 0.254: v91.31,23.37 91.06,23.11 83.57,23.11
  Route15 0.305: v151.64,39.5 151.13,38.99 v138.68,38.99
  Route15 0.711: 82.55,67.44 85.51,64.47 A2.3
  Route15 0.813: 78.36,25.53 91.59,38.76 A2.3 | J1.3 35.28,50.23 35.28,54.45 42.8,61.98 47.37,61.98 56.52,71.12 78.87,71.12 82.55,67.44
  Bottom 0.305: A3.VIN 169.02,33.54 159.93,42.63 159.93,43.84 159.89,43.88 159.89,48.01 158.88,49.02 v156.08,49.02 | v149.99,47.88 149.99,42.42 151.64,40.77 v151.64,39.5 | v135,41.02 125.48,50.55 v106.3,50.55
  pour Route15: -3.43,27.81 -3.43,-1.78 84.2,-1.78 84.2,27.81
+12V  (via drill 0.35, 0.55)
  Top 0.305: U27.2 43.62,7.87 43.81,7.87 43.81,8.16 | U27.1 43.81,8.16 | 43.81,8.16 44.16,8.16 44.45,7.87 44.45,6.6 44.21,6.37 U27.5 44.05,6.37 47.12,3.3 64.17,3.3 72.92,12.05 | C43.1 43.79,8.14 43.81,8.16 | U33.5 111.34,48.04 C55.1 110.99,53.99 v110.11,54.86 | 79.38,29.21 v79.5,29.21 | R95.1 68.38,12.19 v68.33,12.14 | v58.17,14.73 v58.17,14.72 C27.1 C26.1 54.29,15.04 U15.8 53.35,15.24 R69.2
  Top 0.508: TP_12V.1 12V.2 90.74,29.21 v89.79,29.21 | J2.2 70.36,46.54 70.36,41.78 77.47,34.67 77.47,31.11 79.38,29.21 | v79.5,29.21 76.45,26.16 76.45,17.78 74.17,15.49 73.53,15.49 | 73.53,15.49 72.77,16.26 72.77,17.64 R72.1 | R95.1 72.83,12.05 72.92,12.05 73.53,12.66 73.53,15.49
  Top 0.813: A1.3 69.16,64.22 C1.1
  Route15 0.305: v83.69,60.45 83.57,60.58 79.45,60.58 75.81,64.22 A1.3
  Route15 0.813: A1.3 72.89,62.06 72.89,62.04 69.08,58.23 J2.2
  Bottom 0.305: v89.79,29.21 89.41,29.21 | v110.11,54.86 110.11,54.77 89.38,54.77 v83.69,60.45 | v68.33,12.14 68.17,11.99 63.88,11.99 63.85,11.97 60.93,11.97 v58.17,14.73
  Bottom 0.508: v79.5,29.21 89.41,29.21
+24V  (via drill 0.35, 0.4)
  Top 0.254: 24V.2 TP_24V.1
  Top 0.305: C16.1 43.95,34.92 | 43.95,34.92 43.95,33.64 U5.5 | 120.99,71.25 R4.2 127.6,64.64 U2.4 | 137.87,71.25 D4.2 143.14,69.04 R7.1 | v44.07,36.83 44.07,35.04 43.95,34.92 | U3.4 120.06,61.17 118.24,62.99 118.24,71.25 | 24V.2 91.12,34.16 v90.81,34.16 | U4.5 35.55,34.95 C8.1 35.45,36.31 v35.43,36.32
  Top 0.381: A2.1 93.28,71.25 118.24,71.25 120.99,71.25 137.87,71.25 175.78,71.25 IMD.1 198.68,45.21 187.81,45.21 EM.1
  Top 0.813: C2.1 74.9,69.45 A1.1 85.93,69.3 85.98,69.25 | C3.1 85.98,69.25 | 85.98,69.25 91.29,69.25 A2.1 | J1.5 40.53,53.46 40.53,51.53 41.78,50.28 41.78,50.16 48.39,43.56 XF1.3 XF1.4
  Route15 0.305: 39.62,42.16 44.07,37.72 v44.07,36.83 | 34.73,37.27 35.43,36.58 v35.43,36.32
  Route15 0.813: XF1.3 41.02,43.56 39.62,42.16 34.73,37.27 27.8,30.34 TSB.5 | XF1.4 63.17,47.37 63.17,60.58 65.15,62.56 65.15,66.8 67.65,69.3 A1.1
  Bottom 0.305: v90.81,34.16 79.76,34.16 71.88,26.29 23.97,26.29 TSB.5
ACCUMULATOR_GND
  Bottom 0.254: J1.12 48.63,54.22 52.58,58.17 72.14,58.17 77.09,53.21 195.62,53.21 202.11,46.72 202.11,45.68 203.25,44.55 IMD.5
AIR2-
  Top 0.508: J1.11 41.89,54.08 47.75,59.94 Q1.3
AMS_OK  (via drill 0.3, 0.35)
  Top 0.254: v82.68,38.86 82.68,30.1 84.58,28.19 105.47,28.19 AMS_OK.2 113.16,25.65 TP_AMS_OK.1 120.59,33.09 v120.59,36.07 | v120.9,49.28 123.95,52.32 v123.95,60.2 | v126.49,67.94 127.72,67.94 U2.3 130.64,67.18 R3.2
  Bottom 0.254: v120.59,36.07 120.59,48.97 v120.9,49.28 | v123.95,60.2 123.95,65.41 v126.49,67.94 | v82.68,38.86 82.68,46.1 81.08,47.7 J2.6
AMS_OK_3.3V  (via drill 0.65)
  Top 0.254: D3.3 134.73,62.08 R6.1 R5.1 142.49,55.84 v142.49,50.16 | U20.4 156.04,16.3 v154.94,17.4
  Bottom 0.254: v154.94,17.4 154.94,21.34 149.99,26.29 149.99,37.08 144.91,42.16 144.91,47.75 v142.49,50.16
BSPD_CURRENT  (via drill 0.35, 0.4, 0.65)
  Top 0.254: U5.4 46.36,33.61 R23.2 47.41,32.57 v49.4,32.57 49.73,32.89 60.45,32.89 | v146.05,68.83 149.15,68.83 D5.2 153.02,69.16 R9.1 | v83.19,53.98 81.41,52.2 v80.64,52.2
  Top 0.305: 60.45,32.89 60.58,32.89 BSPD_CURRENT.1
  Bottom 0.254: v49.4,32.57 68.83,32.57 J2.14 81.08,45.33 79.67,46.74 79.67,51.22 v80.64,52.2 | v83.19,53.98 135.25,53.98 146.18,64.9 146.18,68.71 v146.05,68.83
BSPD_CURRENT_REF  (via drill 0.35)
  Top 0.254: U4.4 37.85,33.61 R22.2 38.27,33.27 v40.26,33.27
  Bottom 0.254: v40.26,33.27 68.06,33.27 78.08,43.29 J2.13
BSPD_CURRENT_TEENSY  (via drill 0.65)
  Top 0.254: R10.1 153.03,66.29 | 153.03,66.29 R9.2 | v142.62,47.12 144.91,47.12 146.56,48.77 146.56,55.5 154.05,62.99 154.05,65.28 153.03,66.29
  Bottom 0.254: v142.62,47.12 142.62,43.87 142.58,43.83 142.58,32.2 A3.D14
CANH
  Top 0.254: R27.2 126.87,37.59 | 126.87,37.59 U6.7 128.33,37.85 129.79,37.85 130.96,39.01 130.96,42.33 130.94,42.36 130.94,42.55 129.13,44.35 122.78,44.35 122.81,44.32 118.75,40.26 95.63,40.26 92.96,42.93 92.96,49.66 91.57,51.05 75.32,51.05 J2.3 | 126.87,37.59 125.22,35.94 121.92,35.94 119.89,37.97 90.42,37.97 87.25,41.15 76.33,41.15 72.66,44.82 J2.11
CANL
  Top 0.254: J2.12 75.08,43.79 77.09,41.78 87.5,41.78 90.81,38.48 120.02,38.48 122.01,36.48 125.19,36.48 125.6,36.9 125.6,37.97 126.5,38.87 R26.2 127.82,39.12 U6.6 128.33,39.12 130.05,39.12 130.56,39.62 130.56,42.16 128.78,43.94 123.13,43.94 119.04,39.85 95.28,39.85 92.46,42.67 92.46,49.34 92.46,49.4 91.31,50.55 77.81,50.55 J2.4
CHASSIS_GND
  Bottom 0.254: IMD.6 204.88,42.42 202.69,42.42 201.68,43.43 201.68,44.96 201.29,45.34 199.26,45.34 193.04,51.56 93.83,51.56 J2.16
CS_LTC_6820  (via drill 0.35)
  Top 0.254: U7.5 174.82,24.77 174.18,24.13 R45.1 173.06,23.24 171.45,23.24 170.56,24.13 170.56,28.83 168.4,30.99 151.38,30.99 v146.56,35.81 | A3.D10 141.08,43.27 141.1,43.26 141.1,42.16 v143.51,39.75
  Bottom 0.254: v146.56,35.81 143.51,38.86 v143.51,39.75
CURR_N
  Top 0.254: CURRENT_SHUNT.3 99.14,45.97 105.27,45.97 R106.1
CURR_P
  Top 0.254: CURRENT_SHUNT.2 101.42,48.26 R107.1
CURRENT
  Top 0.254: CURRENT_SENSE.1 53.39,29.08 44.79,29.08 R43.2 43.93,30 U5.1 42.55,32.79 42.55,36.7 32,47.24 32,50.04 38.3,56.34 J1.6
CURRENT_REF
  Top 0.254: U4.1 35.55,30 R41.2 | R41.2 35.52,31.5 34.68,32.34 34.68,41.59 33.41,42.86 J1.7 | R41.2 37.43,28.07 62.36,28.07 62.99,28.7 CURRENT_REF.1
CURRENT_SHUNT_OUT  (via drill 0.35)
  Top 0.254: v118.11,44.7 CUR_SHUNT.1 116.08,44.32 R111.2 114.16,44.55 C56.1 114.16,47.14 R110.1
  Bottom 0.254: v118.11,44.7 118.11,35.94 128.02,26.04 141.5,26.04 A3.D16
EM_CANH
  Top 0.254: EM.2 186.75,49.28 164.68,49.28 163.7,50.26 163.7,51.33 R51.2 162.49,52.07 U10.7
EM_CANL
  Top 0.254: EM.3 181.46,48.57 164.34,48.57 164.08,48.83 164.11,48.83 162.72,50.21 R50.2 158.71,50.77 U10.6
EM_CRX  (via drill 0.35)
  Top 0.254: U10.4 153.48,49.28 155.96,46.8 156.91,46.8 v156.97,46.74
  Bottom 0.254: v156.97,46.74 157.37,46.34 157.37,32.2 A3.D23
EM_CTX  (via drill 0.35)
  Top 0.254: U10.1 154.09,52.73 154.17,52.73 155.19,51.7 v155.19,50.93
  Bottom 0.254: v155.19,50.93 155.22,50.9 155.22,31.8 A3.D22
GND  (via drill 0.3, 0.35, 0.4, 0.45, 0.65, 0.85, 0.9)
  Top 0.254: C36.2 150.31,17.21 v151.26,16.26 | R126.1 141.99,16.38 R78.2 | C65.2 131.46,15.75 v131.83,15.75 | C62.2 121.55,17.81 v120.82,17.08 | R76.2 121.73,15.81 v120.4,14.48 | R132.1 123.05,15 v123.7,14.35 | R39.2 6.31,19.3 v5.71,19.3 | C15.2 7.25,17.54 v6.35,16.64 | R66.1 14.39,21.37 v14.86,21.84 | v15.37,18.41 15.86,17.92 R60.1 R59.1 | R36.2 14.81,14.1 v15.19,14.48 | C14.2 14.34,11.06 v14.61,10.79 | R57.1 10.81,8.12 v10.54,8.38 | C23.2 13.8,8.79 v13.46,9.13 | R52.1 R54.1 10.75,2.2 v10.22,1.67 | R56.1 15.58,2.2 v16.13,1.65 | C39.2 19.1,6.03 v19.1,6.6 | R87.1 23.05,4.48 23.7,5.13 v23.7,5.23 | C38.2 24.61,7.68 v24.61,7.44 | R84.1 19.18,11.99 v18.44,12.72 | C24.2 25.43,17.63 25.53,17.53 | R93.1 26.53,12.04 v26.37,12.04 27.08,11.33 R92.1 | R91.1 26.62,9.03 v26.62,8.76 | C41.2 27.94,5.59 v27.18,6.35 | R3.1 132.34,64.94 D3.1 132.73,66.41 v132.46,66.67 | R5.2 136.4,59.18 v136.27,59.05 | U10.8 159.32,53.98 v159.89,53.98 | R133.1 131.65,20.95 v131.98,21.29 | U32.13 178.25,37.47 | 178.25,37.47 U32.14 | 178.25,37.47 R104.2 180.85,36.23 v180.85,35.94 | U7.13 179.52,25.53 | 179.52,25.53 U7.14 | C22.2 178.31,28.69 178.31,26.16 178.94,25.53 179.52,25.53 | C19.1 v150.88,53.98 | D9.1 64.95,22.35 v64.44,22.86 | R110.2 112.69,48.68 v113.67,49.66 | C55.2 109.49,48.88 v108.71,49.66 | R48.1 102.4,24.8 v101.98,24.38 | R25.1 102.4,30.39 v101.73,29.72 | PRECHARGE_OK.1 107.95,36.07 v108.97,35.05 | R74.1 86.4,30.48 v85.7,30.48 | R73.1 86.14,24.64 v86.11,24.64 | R96.1 v86.11,18.76 v86.11,18.75 | R63.1 17.87,20.11 v16.76,21.21 | C54.2 210.19,32.26 v209.42,33.02 | C7.2 210.19,26.42 v209.3,25.53 | TEENSY_OK.1 172.09,14.1 v172.21,13.97 | WATCHDOG.1 v172.34,16.89
  Top 0.254: C43.2 41.53,6.01 v41.53,5.59 | R86.1 18.02,9.65 v17.14,9.65 | U6.8 127.51,35.75 v127.51,35.05 | R79.1 158.91,21.06 v158.69,21.28 | C25.2 21.02,24.32 v21.21,24.51 | C9.1 137.55,36.45 v137.79,36.45 | R18.1 197.27,52.79 v196.52,53.54 | C12.1 121.41,39.8 v121.41,40.26 | R67.1 23.88,22.61 v24.51,23.24
  Top 0.305: U16.2 119.51,18.54 119.13,18.92 117.97,18.92 C29.2 115.69,18.3 v114.94,19.05 | U18.2 138.94,18.67 138.56,19.05 137.53,19.05 C33.2 136.26,17.78 v135.64,17.78 | R39.2 7.05,19.81 8,19.81 | 8,19.81 U9.2 | 8,19.81 7.86,19.67 7.85,19.67 7.25,19.07 C15.2 | C14.2 12.56,11.73 U8.2 | U11.2 13.59,5.84 14.1,6.35 14.1,7.61 C23.2 | C39.2 20.07,5.07 20.07,3.3 19.57,2.8 U23.3 | C38.2 23.7,8.43 22.94,9.19 21.16,9.19 20.47,9.88 U22.2 | C24.2 23.76,18.54 21.59,18.54 20.7,17.65 20.7,17.14 20.47,16.92 U12.2 | U24.3 29.48,18.78 28.96,19.3 27.22,19.3 C40.2 25.74,19.89 v25.74,20.23 | U25.3 27.49,2.92 28.19,2.92 28.57,3.3 28.57,5.24 C41.2 | U26.2 30.99,12.83 31.24,12.57 32.47,12.57 C42.2 33.07,13.51 v33.78,14.22 | C25.2 21.02,21.4 20.7,21.08 U13.2 | U27.4 42.39,6.87 C43.2 | U15.1 59.5,13.92 57.78,12.2 C27.2 C26.2 55.63,11.68 v54.61,10.67 | D10.1 51.74,6.13 R94.2 | U4.2 36.2,34.3 C8.2 38.61,35.05 v39.12,34.54 | U5.2 44.58,34.17 C16.2 46.23,35.05 v46.74,35.56 | C9.1 C10.1 133.4,37.48 U6.2 | C18.1 C19.1 153.36,52.19 U10.2 | C20.1 157.24,52.34 158.24,53.34 U10.8 | v168.78,52.32 168.61,52.15 C21.1 | C55.2 110.24,47.64 110.24,46.74 109.86,46.35 U33.2 | TP_GND.1 108.71,19.68 v109.73,18.67 | R127.1 150.58,21.97 v151.38,21.97 | 141.99,16.38 142.06,16.31 | 142.06,16.31 v142.06,15.27 | 142.06,16.31 141.51,16.31 R78.2 | C31.2 141.11,17.79 v140.84,17.53 | D4.1 140.08,63.5 v139.7,63.12 | R8.2 142.62,63.54 v142.62,62.99 | D5.1 149.48,64.64 v148.34,63.5 | R10.2 152.15,63.41 v152.15,63.25 | D6.1 161.42,63.81 v161.42,63.25 | R12.2 167.17,63.5 v167.39,63.5 | D7.1 171.2,65.75 v171.2,64.39 | R13.2 174.62,64.98 v174.62,64.64 | D8.1 185.93,65.71 v185.93,66.42
  Top 0.305: R16.2 188.49,63.48 v188.85,63.12 | v158.7,17.45 159.5,16.65 C37.1 160.13,16.89 161.78,16.89 162.43,16.24 U21.2 162.43,14.82 R101.1 160.82,13.21 v160.78,13.21 | U20.3 155.65,19.17 v155.65,19.43 | U19.4 124.8,17.84 v124.13,17.17 | C61.2 126.33,20.28 v126.11,20.07 | C30.2 145.43,20.62 v145.47,20.57 | U17.4 143.89,18.11 v143.89,17.53 | C11.1 129.54,41.82 v129.54,40.51 | v175.13,42.8 175.13,41.64 C53.2 | C52.1 177.56,42.04 v178.31,42.04 | C13.1 175.39,30.1 v175.9,30.61 | C22.2 179.07,30.28 v179.45,30.66 | R88.1 27.3,22.52 v27.3,23.11 | 25.53,17.53 25.65,17.4 v25.91,17.4 | R61.1 24.47,14.57 v24.89,14.99 | U27.8 48.39,7.37 49.28,6.48 R94.2 | R94.2 49.25,6.11 v49.25,4.85 | Q4.2 55.45,5.92 v54.86,5.33 | R41.1 32.89,29.97 v32.64,30.23 | C56.2 112.66,47.34 R110.2 | R31.2 183.74,26.16 v184.02,25.88 | R2.2 56.88,59.04 v56.9,59.05 | R17.1 200.57,57.78 v199.9,57.78 | R19.1 204.89,55.79 v204.6,55.5 | R49.1 86.36,36.49 v86.36,37.08 | Q2.2 132.44,61.75 v132.08,62.1 | U3.2 127.64,59.69 v126.62,58.67 | R42.1 39.12,29.97 v39.75,29.34 | R43.1 41.4,30.77 v41.4,31.24 | R44.1 48.26,29.97 v48.39,30.1 | C17.2 52.34,20.32 v51.18,20.32 | R46.1 61.17,21.55 v61.72,22.1 | C28.2 61.86,14.97 v62.61,14.22 | R47.2 64.9,18.16 v65.66,17.4 | Q3.2 69.65,17.73 v70.36,17.02 | R81.1 166.28,15.49 v166.75,15.49 | R20.1 115.32,57.02 v114.68,57.66 | K1.2 39.84,3.47 v40.51,2.79
  Top 0.508: Q1.2 52.18,61.73 v51.18,62.74 | D1.1 56.77,65.6 v56.77,66.29
  Top 0.711: R97.1 70.57,56.01 | 70.57,56.01 R89.1 | 70.57,56.01 70.83,56.26 v72.52,56.26
  Top 0.813: C1.2 68.99,66.8 | 68.99,66.8 C2.2 | A1.2 75.01,66.8 69.47,66.8 | 69.47,66.8 68.99,66.8 | C4.2 C3.2 91.2,67.4 A2.2 | U1.1 106.25,68.06 C5.2 103.64,68.06 v102.74,68.96 | C6.2 v104.39,61.09 | D2.1 66.8,67.06 | 66.8,67.06 69.22,67.06 69.47,66.8 | 66.8,67.06 v66.8,65.41
  Route2 0.254: 201.04,57.28 190.35,46.59 190.35,46.3 186.72,42.67 186.32,42.67 169.12,25.47 23.33,25.47 22.37,24.51 v21.21,24.51
  pour Route2: -11.3,90.93 -11.3,-3.94 -5.21,-10.03 210.95,-10.03 210.95,85.85 204.72,92.08 -10.16,92.08
HV+_OUT_OK
  Top 0.254: U23.4 22.68,2.8 R87.2 23.48,3.56 U25.2
IM
  Top 0.254: T1.10 210.1,28.36 206.72,24.99 183.66,24.99 182.45,23.77 U7.10
IM_2
  Top 0.254: T1.7 180.62,34.14 179.05,35.71 U32.10
IMD_OK  (via drill 0.3, 0.35)
  Top 0.254: v85.6,38.94 85.6,35.05 87.38,33.27 105.35,33.27 IMD_OK.2 113.16,30.86 TP_IMD_OK.1 113.67,30.73 v119.38,36.45 | D6.2 163.07,69.16 | 163.07,69.16 166.23,69.16 R11.1 | v119,49.15 119,55.46 R20.2 119.93,57.02 U3.3 122.56,57.15 v122.68,57.28 | v159.38,68.71 162.61,68.71 163.07,69.16
  Bottom 0.254: v119.38,36.45 119.38,48.77 v119,49.15 | v122.68,57.28 129.54,57.28 142.75,70.48 157.61,70.48 v159.38,68.71 | v85.6,38.94 85.6,46.48 84.26,47.82 J2.7
IMD_OK_TEENSY  (via drill 0.65)
  Top 0.254: A3.D3 161.11,41.15 166.5,41.15 167.77,42.42 v167.77,46.23 | v169.93,50.29 169.93,62.45 R12.1 R11.2
  Bottom 0.254: v167.77,46.23 169.93,48.39 v169.93,50.29
IP
  Top 0.254: U7.11 178.96,24.27 178.79,24.11 178.79,22.99 179.43,22.35 181.61,22.35 183.84,24.58 T1.12
IP_2
  Top 0.254: T1.9 210.03,30.36 206.68,33.71 178.63,33.71 177.16,35.18 177.16,36.07 177.3,36.21 U32.11
ISO_PACK+  (via drill 0.35)
  Top 0.254: R55.2 9.39,14.28 R33.1 9.56,14.26 v11.05,15.75
  Bottom 0.254: TSB.2 19.92,32.87 11.43,24.38 11.43,16.13 v11.05,15.75
ISO_PACK-  (via drill 0.35)
  Top 0.254: v9.78,16.26 8.76,15.24 7.35,15.24 R55.1 R34.1
  Bottom 0.254: TSB.1 10.67,25.33 10.67,17.14 v9.78,16.26
ISO_TS+
  Top 0.254: TSB.4 21.04,38.82 8.42,26.2 R62.2 8.42,23.54 R37.1
ISO_TS-
  Top 0.254: TSB.3 19.81,36.7 10.12,27.01 R62.1 10.08,24.8 R38.1
MHS
  Top 0.254: D8.2 185.55,69.29 185.91,69.29 185.93,69.3 R15.1 197.02,69.3 206.59,59.73 R19.2 206.24,56.67 IMD.3
MHS_TEENSY  (via drill 0.4)
  Top 0.254: R16.1 188.49,66.29 | 188.49,66.29 188.49,67.58 R15.2 | v147.45,49.91 147.45,54.86 v148.97,56.39 | v192.02,57.15 192.02,62.76 188.49,66.29
  Bottom 0.254: A3.D7 148.7,48.15 147.45,49.4 v147.45,49.91 | v148.97,56.39 191.26,56.39 v192.02,57.15
N$1
  Top 0.254: R96.2 3.3V.1
N$2
  Top 0.254: 5V.1 R73.2
N$3
  Top 0.254: U15.2 59.82,16.51 | 59.82,16.51 61.18,16.51 C28.1 | U15.6 54.48,17.78 56.64,17.78 58.04,16.38 59.69,16.38 59.82,16.51
  Top 0.305: R68.1 53.83,17.78 54.48,17.78
N$4
  Top 0.254: R24.1 PRECHARGE_OK.2
N$5
  Top 0.305: U15.5 54.22,19.12 C17.1
N$6
  Top 0.305: U15.7 52.92,16.51 R69.1 R68.2
N$7
  Top 0.508: Q1.1 52.2,59.02 R1.2
N$8
  Top 0.305: U3.1 130.98,57.15 R21.2
N$9
  Top 0.254: OKHS.1 R18.2
N$10
  Top 0.254: R39.1 7.01,21.7 8.51,21.7 | 8.51,21.7 R37.2 | U9.1 8.43,21.62 8.51,21.7
N$11
  Top 0.254: U9.3 8.88,19.16 9.27,19.56 9.27,20.89 R38.2 11.86,21.7 R40.1
N$12
  Top 0.254: R44.2 45.25,31.39 U5.3 46.36,31.41 R23.1
N$13  (via drill 0.35)
  Top 0.254: A3.D11 143.73,38.21 165.74,38.21 166.54,38.21 | 166.54,38.21 U32.2 | U7.2 174.71,26.27 173.57,27.41 R29.1 173.57,31.46 v173.61,31.5 | v166.75,38.41 166.54,38.21
  Bottom 0.254: v173.61,31.5 166.75,38.35 v166.75,38.41
N$14
  Top 0.254: 12V.1 R74.2
N$15
  Top 0.254: U21.1 159.17,15.84 156.97,18.03 U20.2 156.97,19.7 R79.2
N$16
  Top 0.254: U2.1 120.18,70.11 R4.1
N$17
  Top 0.254: R48.2 AMS_OK.1
N$18  (via drill 0.35)
  Top 0.254: R70.1 59.73,12.7 v62.48,12.7 | TP_TSAL_GREEN.1 79.38,18.54 v78.74,18.54 | 52.37,7.83 D10.3
  Top 0.305: U27.9 49.24,7.87 R94.1 52.37,7.83 | R70.1 55.25,8.22 D10.3
  Bottom 0.254: v62.48,12.7 65.28,12.7 66.8,14.22 74.42,14.22 v78.74,18.54
N$19  (via drill 0.35)
  Top 0.254: TP_TSAL_RED.1 79.38,23.11 v78.74,23.11 | v66.55,23.11 66.55,21.73 66.41,21.59
  Top 0.305: R71.1 66.41,21.59 66.41,20.96 65.15,19.7 D9.3 64.01,19.52 R47.1 62.27,17.78 U15.3
  Bottom 0.254: v78.74,23.11 v66.55,23.11
N$20
  Top 0.254: U2.2 120.27,64.64 122.71,62.2 129.88,62.2 Q2.3
N$21
  Top 0.254: R27.1 124.79,39.11 R26.1 123.59,39.12 C12.2
N$22
  Top 0.254: R36.1 R33.2 11.18,14.1 U8.1
N$23
  Top 0.254: U8.3 8.31,11.09 R35.1 8.09,11.48 R34.2
N$24
  Top 0.305: R95.2 74.38,13.69 TSAL_GREEN.2
N$25
  Top 0.254: U6.4 133.29,43.37 135.38,45.47 161.67,45.47 162.81,44.32 162.81,42.8 163.58,42.04 165.23,42.04 166.48,43.29 A3.D0
N$26
  Top 0.254: R125.2 147.9,17.01 R124.1 149.72,17.98 150.95,17.98 151.26,18.29 151.26,19.43 150.62,20.07 C34.2
N$27
  Top 0.254: R25.2 IMD_OK.1
N$28
  Top 0.305: F1.1 68.99,24.97 68.99,44.66 69.08,44.76 J2.10
N$29
  Top 0.254: A3.D1 163.94,44.97 162.94,45.97 134.62,45.97 132.08,43.43 132.08,37.45 133.21,36.32
  Top 0.305: 133.21,36.32 U6.1
N$30
  Top 0.254: Q2.1 133.4,59.98 134.62,59.98 R6.2
N$31
  Top 0.305: F2.1 67.31,15.32 67.31,43.59 J2.9
N$32
  Top 0.254: R49.2 24V.1
N$33
  Top 0.254: R42.2 36.87,31.39 | 36.87,31.39 U4.3 | R22.1 38.08,31.39 36.87,31.39
N$34
  Top 0.305: R50.1 164.54,50.77 C21.2 164.57,52.15 R51.1
N$35
  Top 0.254: R135.1 35.13,4.66 K1.1
N$36
  Top 0.254: U7.16 180.44,27.69 R30.1
N$37
  Top 0.254: U7.15 180.78,26.27 R31.1 182.41,27.69 R30.2
N$38
  Top 0.254: R103.1 179.34,38.71 U32.16
N$39
  Top 0.254: T1.11 211.88,26.47 C7.1
N$40  (via drill 0.35)
  Top 0.254: U32.5 172.76,36.71 R102.1 172.55,36.58 v148.34,36.58
  Bottom 0.254: A3.D9 143.62,41.29 v148.34,36.58
N$41
  Top 0.254: U25.4 29.73,2.96 R135.2
N$42
  Top 0.254: R104.1 181.32,38.23 | 181.32,38.23 R103.2 | U32.15 181.3,38.21 181.32,38.23
N$43
  Top 0.254: A3.D12 141.69,37.71 U32.3 175.4,37.71 175.77,37.34 175.77,36.07 176.76,35.08 176.76,35.01 177.8,33.97 177.8,26.67 176.9,25.77 U7.3 173.96,25.77 R28.1
N$44
  Top 0.254: A3.D13 136,31.1 142.19,37.28 173.09,37.28 173.16,37.21 U32.4 | U7.4 174.72,25.27 174.27,24.82 173.3,24.82 172.97,25.15 172.97,25.26 172.98,25.27 172.98,26.3 172.97,26.3 172.97,27.05 172.72,27.3 172.72,32.38 175.01,34.67 175.01,36.96 174.75,37.21 U32.4 | U32.4
N$45
  Top 0.254: R124.2 C36.1
  Top 0.305: R124.2 148.49,18.46 U17.5
N$46
  Top 0.305: R72.2 74.46,19.46 TSAL_RED.2
N$47
  Top 0.305: R80.1 169.39,16.8 WATCHDOG.2
N$48
  Top 0.254: U18.1 138.29,17.41 138.52,17.18 R77.2 R78.1
N$50
  Top 0.254: C32.2 141.44,22 R122.2 141.41,20.73 R123.1
N$56
  Top 0.254: U17.2 144.23,19.81 | 144.23,19.81 U17.1 144.23,21.92 C32.1 | R126.2 R125.1 145.58,19.14 144.91,19.81 144.23,19.81
N$57
  Top 0.254: U17.3 143.67,19.11 142.66,20.11 | 142.66,20.11 R123.2 | C31.1 142.61,20.05 142.66,20.11
N$58
  Top 0.254: R76.1 118.81,16.15 R75.2 118.86,16.51 U16.1
N$59
  Top 0.305: TEENSY_OK.2 R82.1
N$60
  Top 0.305: Q3.1 68.34,21.44 R71.2
N$61
  Top 0.305: Q4.1 57.33,7.91 R70.2
N$62
  Top 0.254: T1.8 C54.1
N$63
  Top 0.254: U33.1 109.13,47.01 108.49,47.01 108.22,46.74 107.95,46.74 | 107.95,46.74 R108.1 | R107.2 107.78,46.9 107.95,46.74
N$64
  Top 0.254: C57.2 109.64,43.86 | R109.1 109.64,43.86 | U33.3 108.28,45.7 R106.2 109.08,43.86 109.64,43.86
N$67
  Top 0.254: R109.2 111.19,42.44 C57.1 111.34,43.96 111.34,44.07 | U33.4 111.34,44.07 | R111.1 112.43,44.07 111.34,44.07
N$70
  Top 0.254: R131.2 127.76,16.3 R130.1 130.14,17.27 131.44,17.27 131.57,17.4 131.57,18.92 131.06,19.43 C64.2
N$71
  Top 0.254: U19.5 128.95,18.2 129.13,18.02 | 129.13,18.02 R130.2 | C65.1 129.13,18.02
N$72
  Top 0.254: C63.2 122.41,21.74 R128.2 122.39,20.62 R129.1
N$73
  Top 0.254: R132.2 125.9,16.13 R131.1 126.02,19.01 125.53,19.5 U19.2 | C63.1 125.11,20.46 U19.1
  Top 0.305: U19.2 U19.1
N$74
  Top 0.254: C62.1 123.05,19.59 R129.2 123.98,18.85 U19.3
N$75
  Top 0.711: XF1.2 XF1.1 59.47,53.58 Q5.2 62.92,54.24 D11.2 59.87,59.94 D2.2
N$76
  Top 0.711: Q5.1 65.46,55.48 D11.1 68.75,56.9 R89.2 R97.2
OKHS  (via drill 0.35, 0.65)
  Top 0.254: IMD.2 203.25,50.65 203.27,50.67 203.27,50.8 | 203.27,50.8 203.27,56.79 R17.2 | v138.18,55.24 131.36,55.24 R21.1 | 203.27,50.8 OKHS.2 198.69,55.37 194.44,55.37 v194.31,55.24
  Bottom 0.254: v194.31,55.24 v138.18,55.24
PACK+_BUFFER
  Top 0.254: U16.3 U16.4 120.16,21.18 R128.1
PACK+_FILTERED
  Top 0.254: U19.7 128.97,19.5 C64.1 R133.2 132.47,24.38 143.38,24.38 146.16,27.16 A3.D17
  Top 0.305: U19.7 U19.6
PACK+_OUT  (via drill 0.35)
  Top 0.254: R57.2 11.63,11.05 U8.4 | R35.2 8.13,9.56 11.38,9.56 R57.2 | R57.2 13,8.45 U11.1 | R57.2 15.66,9.82 17.4,11.56 | 17.4,11.56 17.42,11.58 R58.2 17.46,13.31 17.46,13.4 17.53,13.46 v21.72,13.46 | U22.3 19.42,10.55 18.4,11.56 18.37,11.56 18.38,11.56 17.4,11.56 | v32,17.78 37.85,23.62 PACK+_OUT_TEST.1 41.02,23.62 v41.15,23.75 | v115.32,16 115.57,16.26 116.78,16.26 116.83,16.31 R75.1
  Bottom 0.254: v32,17.78 28.7,17.78 24.38,13.46 v21.72,13.46 | v41.15,23.75 57.4,23.75 60.96,20.19 81.79,20.19 86.87,15.11 114.43,15.11 v115.32,16
PRECHARGE+_OUT_OK
  Top 0.254: R88.2 29.5,20.55 U24.4 30.1,19.91 30.1,17.65 27.94,15.49 26.47,15.49 25.53,14.55 25.53,6.15 U25.1
PRECHARGE_OK  (via drill 0.3, 0.35, 0.45)
  Top 0.254: R14.1 175.41,67.81 D7.3 172.09,57.91 v171.83,57.66 | v140.34,56.26 140.34,54.61 132.84,47.12 122.05,47.12 v117.22,42.29 | v116.46,36.32 115.95,35.81 PC_OK.1 112.14,36.83 103.16,36.83 R24.2 102.02,36.45 v101.09,36.45 | v58.04,60.07 56.17,60.07 R2.1 | v103.12,55.88 103.25,55.75 103.25,49.53 v103.12,49.4 | 50.79,27.38 30.79,27.38 | v30.86,15.88 30.86,27.3 30.79,27.38 | 30.79,27.38 24.16,34.01 TSB.7 | v35.69,13.59 36.32,12.95 K1.3
  Top 0.305: v64.39,27.43 64.34,27.38 50.79,27.38 | v88.14,37.97 88.77,37.34 100.2,37.34 v101.09,36.45
  Top 0.508: R1.1 54.61,60.72 | 54.61,60.72 55.47,60.72 R2.1 | 54.61,60.72 54.74,60.84 D1.3
  Bottom 0.254: v171.83,57.66 141.73,57.66 v140.34,56.26 | v117.22,42.29 116.71,41.78 116.71,36.58 v116.46,36.32 | v58.04,60.07 77.22,60.07 78.36,61.21 97.54,61.21 102.87,55.88 v103.12,55.88 | v103.12,49.4 103.12,44.68 102.59,44.15 102.59,37.95 v101.09,36.45 | v30.86,15.88 33.4,15.88 v35.69,13.59
  Bottom 0.305: v64.39,27.43 69.98,27.43 80.52,37.97 v88.14,37.97
PRECHARGE_OK_TEENSY  (via drill 0.35)
  Top 0.254: R14.2 177,67.69 R13.1 177,50.59 v177.04,50.55 | v177.29,47.12 170.43,40.26 158.24,40.26 156.32,42.18 A3.D4
  Bottom 0.254: v177.04,50.55 177.16,50.55 177.16,47.24 v177.29,47.12
PRECHARGE_REACHED
  Top 0.254: R61.2 27.44,16.27 28.83,17.65 U24.2
  Top 0.305: U12.4 R61.2
SHDN
  Route15 0.813: TSB.6 22.04,34.61 31.81,44.38 31.85,44.38 33.21,45.74 J1.8
  Bottom 0.813: J1.8 35.53,47.85 37.97,50.29 39.45,50.29 J1.10 48.33,49.98 53.98,55.63 63.12,55.63 68.58,50.16 75.73,50.16 J2.5
TD1+
  Top 0.254: T1.4 229.65,30.36 230.57,31.28 R32.2 234.8,31.28 TD1.1 237.75,30.49 240.17,28.07 TD+.1
TD1-
  Top 0.254: TD-.1 237.58,33.49 TD1.2 235.08,32.98 232.66,32.98 R32.1 230.5,34.12 228.02,34.12 228.03,34.14 T1.6
TD2+
  Top 0.254: T1.1 229.52,24.58 R105.2 231.61,25.57 234.28,22.89 234.28,21.59 TD2.1 234.28,21.05 TD+2.1
TD2-
  Top 0.254: T1.3 229.58,28.36 230.5,27.43 R105.1 231.52,27.27 TD2.2 240.41,18.38 TD-2.1
TEENSY_OK  (via drill 0.35)
  Top 0.254: U21.3 163.02,16.2 163.02,16.56 162.31,17.28 162.31,20.45 158.88,23.88 154.56,23.88 v154.31,24.13
  Top 0.305: R82.2 R101.2 163.41,15.81 U21.3
  Bottom 0.254: v154.31,24.13 152.53,25.91 152.53,42.11 A3.D6
TIMER_EN
  Top 0.254: R46.2 57.82,22.35 51.94,22.35 49.02,19.43 49.02,9.53 47.86,8.37 U27.10
  Top 0.305: U15.4 59.48,19.07 R46.2
TS+_OUT  (via drill 0.35)
  Top 0.254: U9.4 11.14,19.67 R40.2 R66.2 13.96,19.43 v17.14,19.43 18.16,19.43 19.68,17.91 U12.1 19.68,19.87 U13.3 | TS+_OUT_TEST.1 38.35,17.91 38.23,18.03 v34.67,18.03 31.67,15.04 31.67,15.08 31.64,15.04 U26.1 | v135.25,15.88 135.76,16.38 R77.1
  Bottom 0.254: v17.14,19.43 33.27,19.43 v34.67,18.03 | 94.74,9.91 129.29,9.91 v135.25,15.88
  Bottom 0.305: v34.67,18.03 34.67,16.89 41.66,9.91 94.74,9.91
TS+_OUT_BUFFER
  Top 0.254: U18.3 U18.4 139.59,21.84 R122.1
TS+_OUT_FILTERED
  Top 0.254: U17.6 U17.7 148.16,19.76 C34.1 148.47,21.56 R127.2 148.5,27.95 A3.D18
TS+_OUT_OV_OK
  Top 0.254: U13.4 R67.2 26.28,18.03 27.88,18.03 U24.1
TSAL_GREEN
  Top 0.305: TSAL_GREEN.1 72.5,13.51 F2.2 67.18,13.46 58.43,4.71 Q4.3
TSAL_RED
  Top 0.305: F1.2 70.38,18.71 Q3.3 71.75,18.67 71.97,18.67 TSAL_RED.1
V_PACK_REF_OV_OK
  Top 0.254: U23.1 18.88,4.1 18.39,4.6 R86.2 18.42,8.35 U22.4
V_PACK_REF_UV_OK
  Top 0.254: U11.4 15.11,5.11 R56.2 16.55,3.9 16.99,3.45 U23.2
WATCHDOG_INPUT  (via drill 0.35)
  Top 0.254: v162.94,21.21 163.19,20.95 165.61,20.95 WATCHDOG_INPUT.1 165.86,20.7 165.86,19.39 | R81.2 163.43,18.5
  Top 0.305: 163.43,18.5 U21.4 | 165.86,19.39 R81.2 R80.2
  Bottom 0.254: A3.D5 153.78,30.11 155.19,28.7 155.19,25.78 159.77,21.21 v162.94,21.21

## Text on the board
tPlace: Accumulator Control Unit rev6 / Designed by Liwei Sun, Zekun / Li, Shayan Noorani, Ethan Su